# Altium project AC_BASE-V2.0.PrjPcb
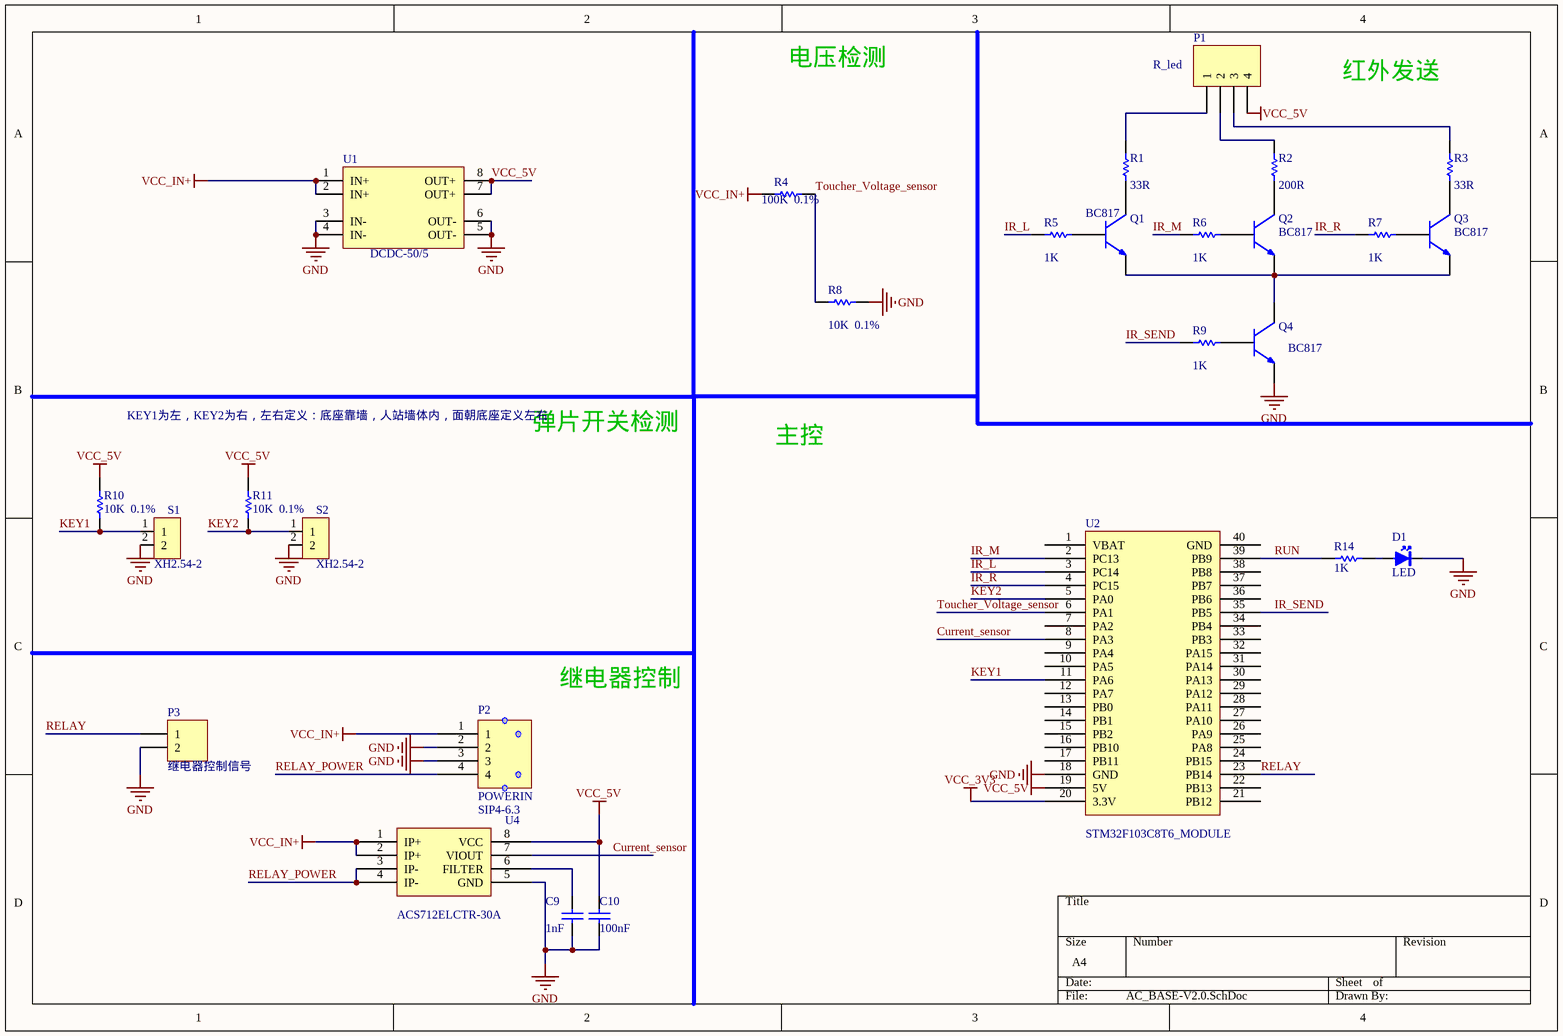
[diagram p0: AC_BASE-V2.0.SchDoc]
1 sheet, 27 parts. Net scope: global (net labels, ports and power ports of the same name join across sheets).
Board file: AC_BASE-V2.0.PcbDoc

## Sheet AC_BASE-V2.0.SchDoc
size A4

### Parts
C9  value 1nF  [C0805]  (hidden comment: Cap)
C10  value 100nF  [C0805]  (hidden comment: Cap)
D1  LED  [LED-H-R2.54]
P1  R_led  [XH2.54-4P]
P2  POWERIN  value SIP4-6.3  [PORT-SIP4-6.3-WA-LOCK]
P3  继电器控制信号  [XH2.54-2P]
Q1  BC817  [SOT-23_N]
Q2  BC817  [SOT-23_N]
Q3  BC817  [SOT-23_N]
Q4  BC817  [SOT-23_N]
R1  value 33R  [R0805]  (hidden comment: Res1)
R2  value 200R  [R0805]  (hidden comment: Res1)
R3  value 33R  [R0805]  (hidden comment: Res1)
R4  value 100K  0.1%  [R0805]  (hidden comment: Res1)
R5  value 1K  [R0805]  (hidden comment: Res1)
R6  value 1K  [R0805]  (hidden comment: Res1)
R7  value 1K  [R0805]  (hidden comment: Res1)
R8  value 10K  0.1%  [R0805]  (hidden comment: Res1)
R9  value 1K  [R0805]  (hidden comment: Res1)
R10  value 10K  0.1%  [R0805]  (hidden comment: Res1)
R11  value 10K  0.1%  [R0805]  (hidden comment: Res1)
R14  value 1K  [R0805]  (hidden comment: Res1)
S1  value XH2.54-2  [XH2.54-2P]  (hidden comment: ON)
S2  value XH2.54-2  [XH2.54-2P]  (hidden comment: ON)
U1  DCDC-50/5  [DCDC50/5]
U2  STM32F103C8T6_MODULE  [STM32F103C8T6_MODE]
U4  ACS712ELCTR-30A  [ACS712-SOIC8]

### Nets
GND: C9.1 C10.1 D1.2(K) P2.2 P2.3 P3.2 Q4.2(E) R8.2 S1.2 S2.2 U1.3(IN-) U1.4(IN-) U1.5(OUT-) U1.6(OUT-) U2.18(GND) U4.5(GND)
VCC_3V3: U2.20(3.3V)
VCC_5V: C10.2 P1.4 R10.2 R11.2 U1.7(OUT+) U1.8(OUT+) U2.19(5V) U4.8(VCC)
VCC_IN+: P2.1 R4.1 U1.1(IN+) U1.2(IN+) U4.1(IP+) U4.2(IP+)
Current_sensor: U2.8(PA3) U4.7(VIOUT)
IR_L: R5.1 U2.3(PC14)
IR_M: R6.1 U2.2(PC13)
IR_R: R7.1 U2.4(PC15)
IR_SEND: R9.1 U2.35(PB5)
KEY1: R10.1 S1.1 U2.11(PA6)
KEY2: R11.1 S2.1 U2.5(PA0)
RELAY: P3.1 U2.23(PB14)
RELAY_POWER: P2.4 U4.3(IP-) U4.4(IP-)
RUN: R14.2 U2.39(PB9)
Toucher_Voltage_sensor: R4.2 R8.1 U2.6(PA1)
NetC9_2: C9.2 U4.6(FILTER)
NetD1_1: D1.1(A) R14.1
NetP1_1: P1.1 R1.2
NetP1_2: P1.2 R2.2
NetP1_3: P1.3 R3.2
NetQ1_1: Q1.1(B) R5.2
NetQ1_2: Q1.2(E) Q2.2(E) Q3.2(E) Q4.3(C)
NetQ1_3: Q1.3(C) R1.1
NetQ2_1: Q2.1(B) R6.2
NetQ2_3: Q2.3(C) R2.1
NetQ3_1: Q3.1(B) R7.2
NetQ3_3: Q3.3(C) R3.1
NetQ4_1: Q4.1(B) R9.2

Not connected (* = marked no-connect by the designer): U2 1(VBAT) 7(PA2) 9(PA4) 10(PA5) 12(PA7) 13(PB0) 14(PB1) 15(PB2) 16(PB10) 17(PB11) 21(PB12) 22(PB13) 24(PB15) 25(PA8) 26(PA9) 27(PA10) 28(PA11) 29(PA12) 30(PA13) 31(PA14) 32(PA15) 33(PB3) 34(PB4) 36(PB6) 37(PB7) 38(PB8) 40(GND)

### Notes on the sheet
- 电压检测
- 红外发送
- KEY1为左，KEY2为右，左右定义：底座靠墙，人站墙体内，面朝底座定义左右
- 弹片开关检测
- 主控
- 继电器控制

### Library data of the parts
C9 C10 = Cap: Capacitor; Published: 8-Jun-2000; LatestRevisionDate: 17-Jul-2002; LatestRevisionNote: Re-released for DXP Platform.; PackageReference: RAD-0.3; Publisher: Altium Limited; PackageDescription: Radial Cap, Thru-Hole; 2 Leads; 0.3 in Pin Spacing
D1 = LED: Value: LED-H-R2.54
P1 = Header 4: Header, 4-Pin; Value: XH2.54-4; LatestRevisionDate: 17-Jul-2002; LatestRevisionNote: Re-released for DXP Platform.; Publisher: Altium Limited
P2 = CONN_4PIN
P3 = Header 2: Header, 2-Pin; Value: XH2.54-2; LatestRevisionDate: 17-Jul-2002; LatestRevisionNote: Re-released for DXP Platform.; Publisher: Altium Limited
Q1-Q4 = mNPN: NPN 45V 功耗 310mW; Value: BC817
R1-R11 R14 = Res1: Resistor; Published: 8-Jun-2000; LatestRevisionDate: 17-Jul-2002; LatestRevisionNote: Re-released for DXP Platform.; PackageReference: AXIAL-0.3; Publisher: Altium Limited; PackageDescription: Axial Device, Thru-Hole; 2 Leads; 0.3 in Pin Spacing
S1 S2 = Conn_1*2
U2 = STM32F103C8T6_MODE: Value: STM32F103C8T6_MODULE
U4 = ACS712: value: ACS712ELCTR-30A
U1 = DCDC-50/5: Value: DCDC-50/5